# EAGLE schematic IntegratedSensor (EAGLE 6.3)
Menlo Park Innovation LLC Sensor Front End Electronics
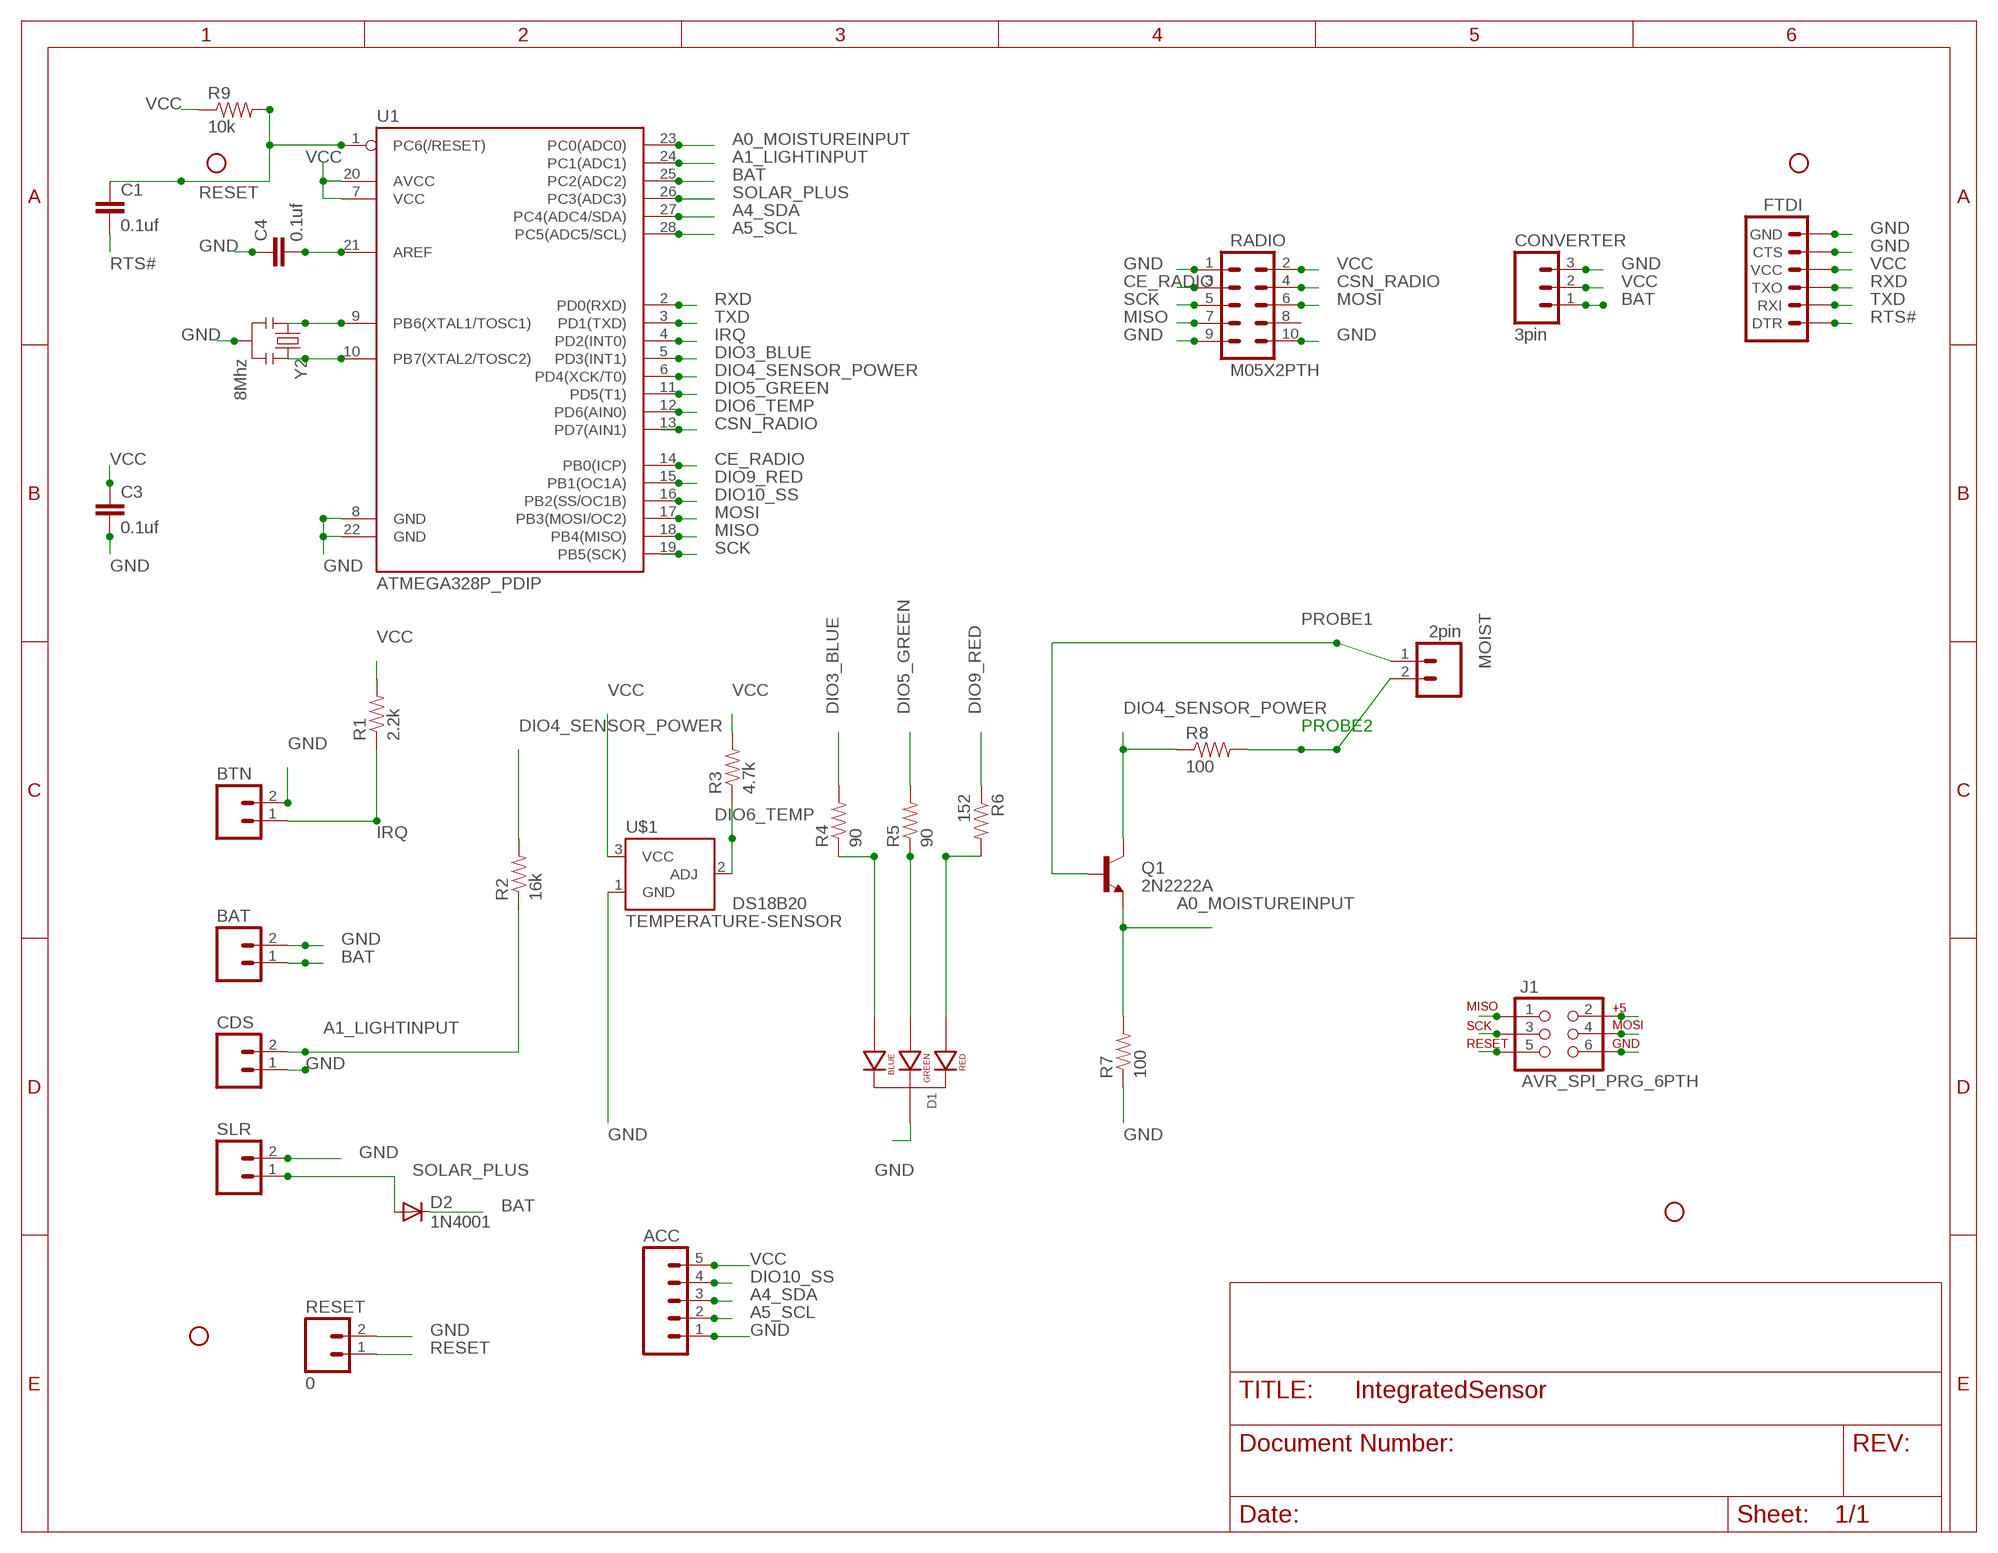
[diagram p0: schematic, sheet 1]

## Parts
ACC  M05PTH  [1X05]
BAT  M02PTH  [1X02]
BTN  M02PTH  [1X02]
C1  0.1uf  CAPPTH  [CAP-PTH-SMALL]
C3  0.1uf  CAPPTH  [CAP-PTH-SMALL]
C4  0.1uf  CAPPTH  [CAP-PTH-SMALL]
CDS  M02PTH  [1X02]
CONVERTER  3pin  M03PTH  [1X03]
D1  LED-RGB-CC-THRUCLEAR  [LED-RGB-THRU]
D2  1N4001  DIODEPTH  [DIODE-1N4001]
FTDI  ARDUINO_SERIAL_PROGRAMPTH  [1X06]
J1  AVR_SPI_PRG_6PTH  [2X3]
MOIST  2pin  M02PTH  [1X02]
Q1  2N2222A  TRANSISTOR_NPNTO-92-AMMO  [TO-92-AMMO]
R1  2.2k  RESISTORPTH-1/6W  [1/6W-RES]
R2  16k  RESISTORPTH-1/6W  [1/6W-RES]
R3  4.7k  RESISTORPTH-1/6W  [1/6W-RES]
R4  90  RESISTORPTH-1/6W  [1/6W-RES]
R5  90  RESISTORPTH-1/6W  [1/6W-RES]
R6  152  RESISTORPTH-1/6W  [1/6W-RES]
R7  100  RESISTORPTH-1/6W  [1/6W-RES]
R8  100  RESISTORPTH-1/6W  [1/6W-RES]
R9  10k  RESISTORPTH-1/6W  [1/6W-RES]
RADIO  M05X2PTH  [AVR_ICSP]
RESET  0  M02PTH  [1X02]
SLR  M02PTH  [1X02]
STANDOFF1  STAND-OFF  [STAND-OFF]
STANDOFF2  STAND-OFF  [STAND-OFF]
STANDOFF3  STAND-OFF  [STAND-OFF]
STANDOFF4  STAND-OFF  [STAND-OFF]
U1  ATMEGA328P_PDIP  [DIL28-3]
U$1  TEMPERATURE-SENSOR  [TO-92]
Y2  8Mhz  RESONATORPTH  [RESONATOR-PTH]

## Nets
A0_MOISTUREINPUT: Q1.1(E) R7.2 U1.23(PC0(ADC0))
A1_LIGHTINPUT: CDS.2 R2.1 U1.24(PC1(ADC1))
A4_SDA: ACC.3 U1.27(PC4(ADC4/SDA))
A5_SCL: ACC.2 U1.28(PC5(ADC5/SCL))
BAT: BAT.1 CONVERTER.1 D2.C U1.25(PC2(ADC2))
CE_RADIO: RADIO.3 U1.14(PB0(ICP))
CSN_RADIO: RADIO.4 U1.13(PD7(AIN1))
DIO3_BLUE: R4.2 U1.5(PD3(INT1))
DIO4_SENSOR_POWER: Q1.3(C) R2.2 R8.1 U1.6(PD4(XCK/T0))
DIO5_GREEN: R5.2 U1.11(PD5(T1))
DIO6_TEMP: R3.1 U1.12(PD6(AIN0)) U$1.2(ADJ)
DIO9_RED: R6.1 U1.15(PB1(OC1A))
DIO10_SS: ACC.4 U1.16(PB2(SS/OC1B))
GND: ACC.1 BAT.2 BTN.2 C3.2 C4.1 CDS.1 CONVERTER.3 D1.2(CATHODE) FTDI.5(CTS) FTDI.6(GND) J1.6 R7.1 RADIO.1 RADIO.9 RADIO.10 RESET.2 SLR.2 U1.8(GND) U1.22(GND) U$1.1(GND) Y2.2
IRQ: BTN.1 R1.1 U1.4(PD2(INT0))
MISO: J1.1 RADIO.7 U1.18(PB4(MISO))
MOSI: J1.4 RADIO.6 U1.17(PB3(MOSI/OC2))
N$1: D1.4(BLUE_CATHODE) R4.1
N$2: D1.3(GREEN_CATHODE) R5.1
N$3: D1.1(RED_CATHODE) R6.2
N$5: U1.9(PB6(XTAL1/TOSC1)) Y2.1
N$6: U1.10(PB7(XTAL2/TOSC2)) Y2.3
N$8: C4.2 U1.21(AREF)
PROBE1: MOIST.1 Q1.2(B)
PROBE2: MOIST.2 R8.2
RESET: C1.1 J1.5 R9.2 RESET.1 U1.1(PC6(/RESET))
RTS#: C1.2 FTDI.1(DTR)
RXD: FTDI.3(TXO) U1.2(PD0(RXD))
SCK: J1.3 RADIO.5 U1.19(PB5(SCK))
SOLAR_PLUS: D2.A SLR.1 U1.26(PC3(ADC3))
TXD: FTDI.2(RXI) U1.3(PD1(TXD))
VCC: ACC.5 C3.1 CONVERTER.2 FTDI.4(VCC) J1.2 R1.2 R3.2 R9.1 RADIO.2 U1.7(VCC) U1.20(AVCC) U$1.3(VCC)
Unconnected: RADIO.8

## Library data of the parts
ACC = SparkFun-Connectors:M05: Header 5 Standard 5-pin 0.1" header. Use with straight break away headers (SKU : PRT-00116), right angle break away headers (PRT-00553), swiss pins (PRT-00743), machine pins (PRT-00117), and female headers (PRT-00115). Molex polarized connector foot print use with SKU : PRT-08230 with associated crimp pins and housings.
BAT BTN CDS MOIST RESET SLR = SparkFun-Connectors:M02: Header 2 Standard 2-pin 0.1" header. Use with straight break away headers (SKU : PRT-00116), right angle break away headers (PRT-00553), swiss pins (PRT-00743), machine pins (PRT-00117), and female headers (PRT-00115). Molex polarized connector foot print use with SKU : PRT-08233 with associated crimp pins and housings.
C1 C3 C4 = SparkFun-Capacitors:CAP: Capacitor Standard 0603 ceramic capacitor, and 0.1" leaded capacitor.
CONVERTER = SparkFun-Connectors:M03: Header 3 Standard 3-pin 0.1" header. Use with straight break away headers (SKU : PRT-00116), right angle break away headers (PRT-00553), swiss pins (PRT-00743), machine pins (PRT-00117), and female headers (PRT-00115). Molex polarized connector foot print use with SKU : PRT-08232 with associated crimp pins and housings.
D1 = SparkFun-LED-MenloFix:LED-RGB-CC-THRU: RGB Through-hole common cathode LED SparkFun Storefront: COM-00105 (Clear) COM-09264 (Diffuse); PROD_ID: DIO-08418
D2 = SparkFun-DiscreteSemi:DIODE: Diode These are standard reverse protection diodes and small signal diodes. SMA package can handle up to about 1A. SOD-323 can handle about 200mA. What the SOD-323 package when ordering, there are some mfgs out there that are 5-pin packages.
FTDI = SparkFun-Connectors:ARDUINO_SERIAL_PROGRAM: FTDI connector footprints
J1 = SparkFun-Connectors:AVR_SPI_PRG_6: AVR ISP 6 Pin This is the reduced ISP connector for AVR programming. Common on Arduino. This footprint will take up less PCB space and can be used with a 10-pin to 6-pin adapter such as SKU: BOB-08508
Q1 = SparkFun-DiscreteSemi:TRANSISTOR_NPN: Generic NPN BJT. MMBT2222 is the common NPN we use. Double check against datasheet- not all devices are the same!
R1-R9 = SparkFun-Resistors:RESISTOR: Resistor Basic schematic elements and footprints for 0603, 1206, and PTH resistors.
RADIO = SparkFun-Connectors:M05X2: Header 5x2 Standard 10-pin dual row 0.1" header. Commonly used with AVR-ISP. Use with Spark Fun Electronics SKU: PRT-00778
STANDOFF1-STANDOFF4 = SparkFun-Electromechanical:STAND-OFF: #4 Stand Off This is the mechanical footprint for a #4 phillips button head screw. Use the keepout ring to avoid running the screw head into surrounding components. SKU : PRT-00447
U1 = SparkFun-DigitalIC:ATMEGA328P_PDIP: uC used in the Arduino 32kb flash, 1k EEPROM, 2k SRAM This is the through-hole version of this chip.
U$1 = SparkFun-Sensors:TEMPERATURE-SENSOR: TO-92 temp sensor; PARTNAME: DS18B20
Y2 = SparkFun-FreqCtrl:RESONATOR: Resonator Small SMD resonator. Used, eg, on the Arduino Pro/ Pro Mini boards. 8MHz- XTAL-08895 16MHz- XTAL-08900